# Altium schematic sheet Y_Stepper Motor Driver.SchDoc
size 300 x 299 mm; SheetNumber: 2; SheetTotal: 5
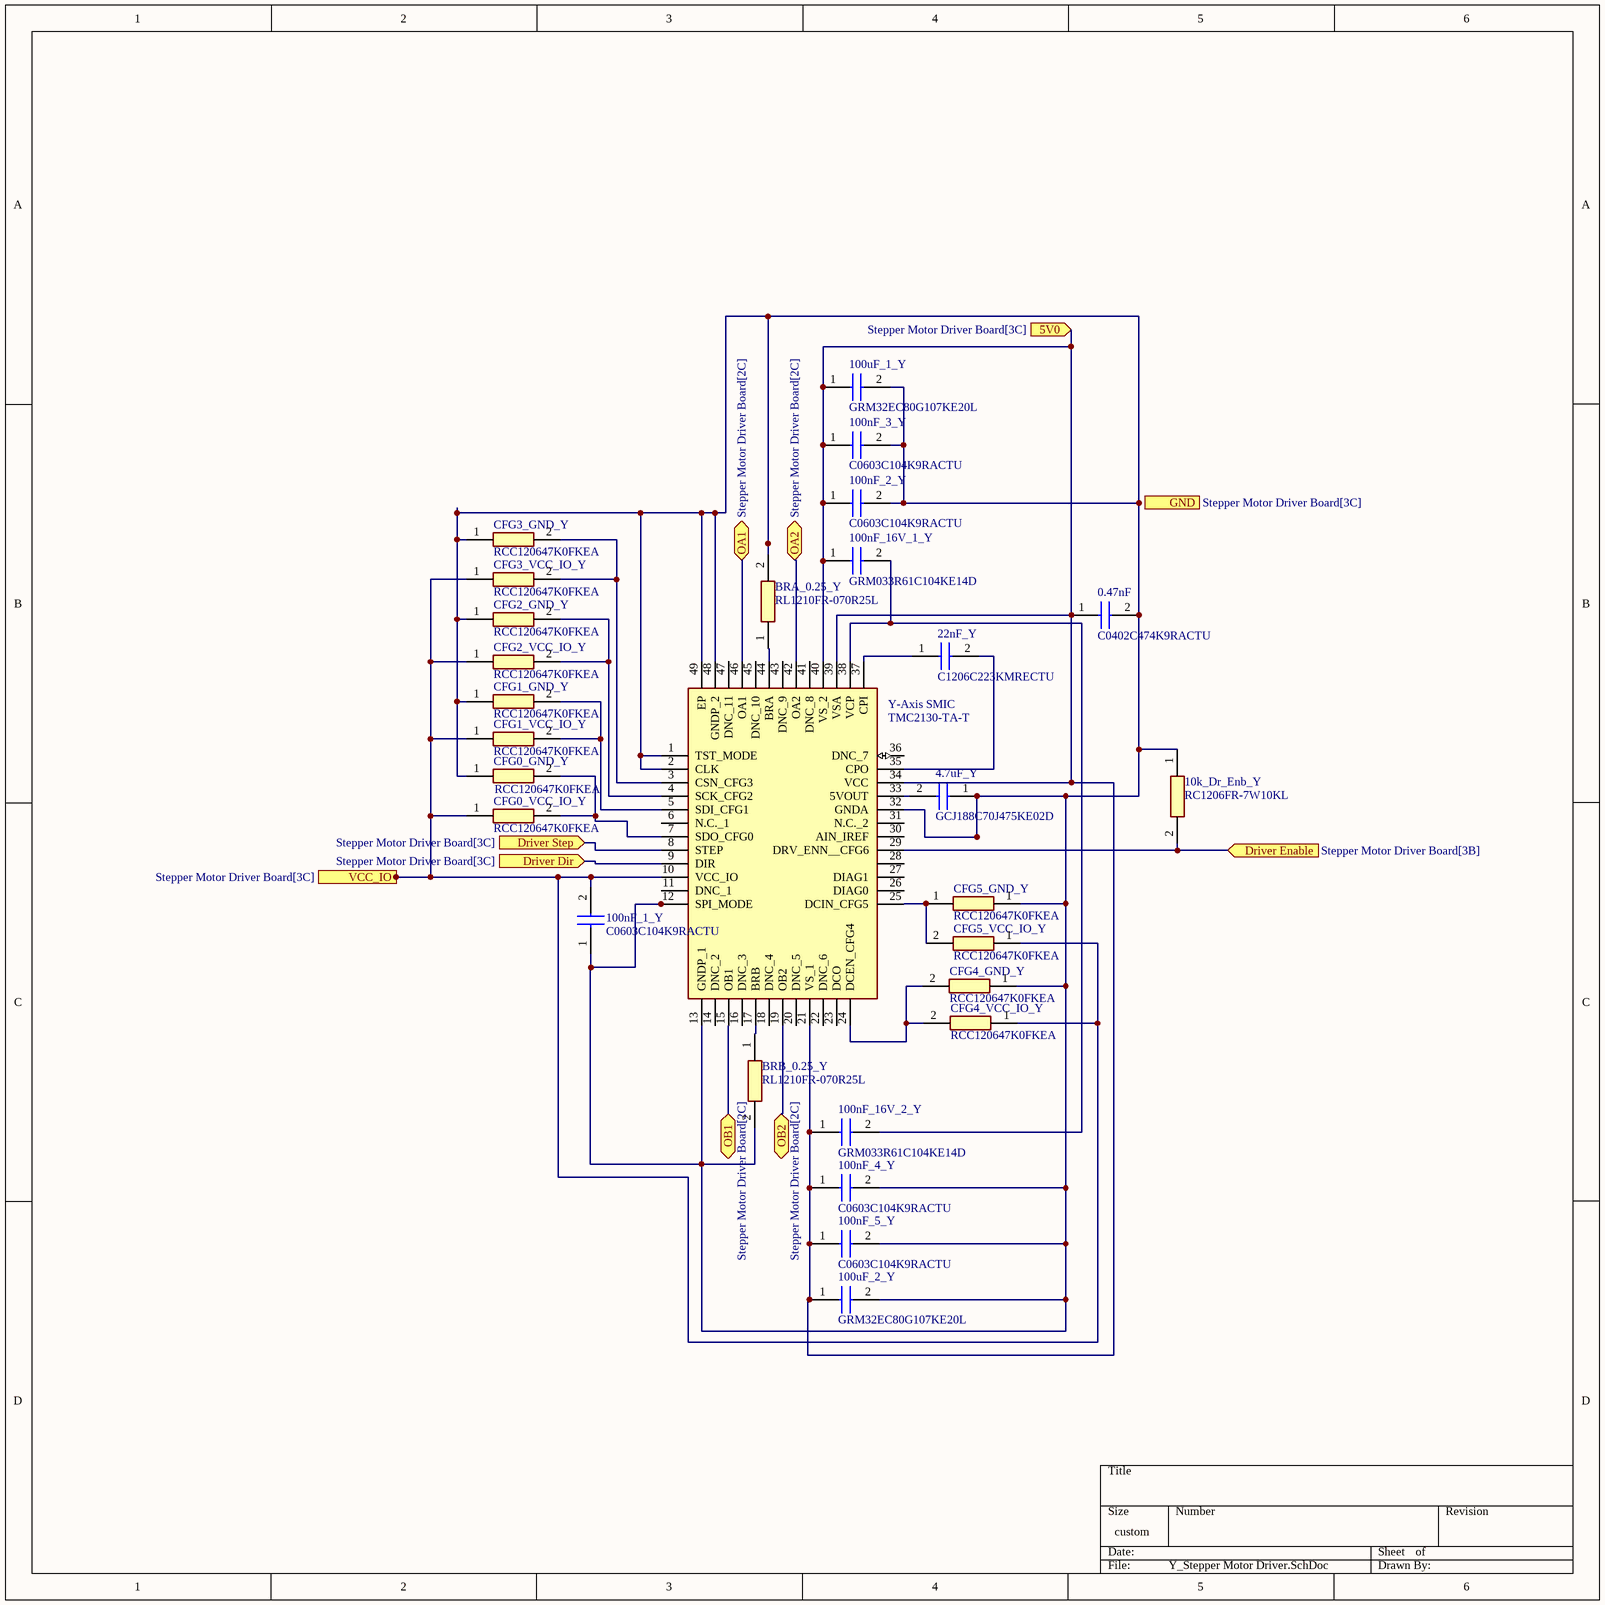
[diagram p0: Y_Stepper Motor Driver.SchDoc]

## Parts
0.47nF  C0402C474K9RACTU  [CAPC1005X55N]
4.7uF_Y  GCJ188C70J475KE02D  [CAPC1608X100N]
10k_Dr_Enb_Y  RC1206FR-7W10KL  [RESC3116X65N]
22nF_Y  C1206C223KMRECTU  [C1206]
100nF_1_Y  C0603C104K9RACTU  [C0603]
100nF_2_Y  C0603C104K9RACTU  [C0603]
100nF_3_Y  C0603C104K9RACTU  [C0603]
100nF_4_Y  C0603C104K9RACTU  [C0603]
100nF_5_Y  C0603C104K9RACTU  [C0603]
100nF_16V_1_Y  GRM033R61C104KE14D  [CAPC0603X33N]
100nF_16V_2_Y  GRM033R61C104KE14D  [CAPC0603X33N]
100uF_1_Y  GRM32EC80G107KE20L  [CAPC3225X270N]
100uF_2_Y  GRM32EC80G107KE20L  [CAPC3225X270N]
BRA_0.25_Y  RL1210FR-070R25L  [RESC3126X65N]
BRB_0.25_Y  RL1210FR-070R25L  [RESC3126X65N]
CFG0_GND_Y  RCC120647K0FKEA  [RCC1206_e3]
CFG0_VCC_IO_Y  RCC120647K0FKEA  [RCC1206_e3]
CFG1_GND_Y  RCC120647K0FKEA  [RCC1206_e3]
CFG1_VCC_IO_Y  RCC120647K0FKEA  [RCC1206_e3]
CFG2_GND_Y  RCC120647K0FKEA  [RCC1206_e3]
CFG2_VCC_IO_Y  RCC120647K0FKEA  [RCC1206_e3]
CFG3_GND_Y  RCC120647K0FKEA  [RCC1206_e3]
CFG3_VCC_IO_Y  RCC120647K0FKEA  [RCC1206_e3]
CFG4_GND_Y  RCC120647K0FKEA  [RCC1206_e3]
CFG4_VCC_IO_Y  RCC120647K0FKEA  [RCC1206_e3]
CFG5_GND_Y  RCC120647K0FKEA  [RCC1206_e3]
CFG5_VCC_IO_Y  RCC120647K0FKEA  [RCC1206_e3]
Y-Axis_SMIC  TMC2130-TA-T  [QFP50P900X900X120-49N]

## Ports
5V0 (in, see Stepper Motor Driver Board[3C]), Driver Dir (in, see Stepper Motor Driver Board[3C]), Driver Enable (in, see Stepper Motor Driver Board[3B]), Driver Step (in, see Stepper Motor Driver Board[3C]), GND (see Stepper Motor Driver Board[3C]), OA1 (bidir, see Stepper Motor Driver Board[2C]), OA2 (bidir, see Stepper Motor Driver Board[2C]), OB1 (bidir, see Stepper Motor Driver Board[2C]), OB2 (bidir, see Stepper Motor Driver Board[2C]), VCC_IO (in, see Stepper Motor Driver Board[3C])

## Nets
5V0: 0.47nF.1 100nF_2_Y.1 100nF_3_Y.1 100nF_4_Y.1 100nF_5_Y.1 100nF_16V_1_Y.1 100nF_16V_2_Y.1 100uF_1_Y.1 100uF_2_Y.1 Y-Axis_SMIC.21(VS_1) Y-Axis_SMIC.34(VCC) Y-Axis_SMIC.39(VSA) Y-Axis_SMIC.40(VS_2) ; port 5V0
Driver Dir: Y-Axis_SMIC.9(DIR) ; port Driver Dir
Driver Enable: 10k_Dr_Enb_Y.2 Y-Axis_SMIC.29(DRV_ENN__CFG6) ; port Driver Enable
Driver Step: Y-Axis_SMIC.8(STEP) ; port Driver Step
OA1: Y-Axis_SMIC.46(OA1) ; port OA1
OA2: Y-Axis_SMIC.42(OA2) ; port OA2
OB1: Y-Axis_SMIC.15(OB1) ; port OB1
OB2: Y-Axis_SMIC.19(OB2) ; port OB2
VCC_IO: 100nF_1_Y.2 CFG0_VCC_IO_Y.1 CFG1_VCC_IO_Y.1 CFG2_VCC_IO_Y.1 CFG3_VCC_IO_Y.1 CFG4_VCC_IO_Y.1 CFG5_VCC_IO_Y.1 Y-Axis_SMIC.10(VCC_IO) ; port VCC_IO
Net0.47nF_2: 0.47nF.2 4.7uF_Y.1 10k_Dr_Enb_Y.1 100nF_1_Y.1 100nF_2_Y.2 100nF_3_Y.2 100nF_4_Y.2 100nF_5_Y.2 100uF_1_Y.2 100uF_2_Y.2 BRA_0.25_Y.2 BRB_0.25_Y.2 CFG0_GND_Y.1 CFG1_GND_Y.1 CFG2_GND_Y.1 CFG3_GND_Y.1 CFG4_GND_Y.1 CFG5_GND_Y.1 Y-Axis_SMIC.1(TST_MODE) Y-Axis_SMIC.2(CLK) Y-Axis_SMIC.12(SPI_MODE) Y-Axis_SMIC.13(GNDP_1) Y-Axis_SMIC.32(GNDA) Y-Axis_SMIC.48(GNDP_2) Y-Axis_SMIC.49(EP)
Net4.7uF_Y_2: 4.7uF_Y.2 Y-Axis_SMIC.33(5VOUT)
Net22nF_Y_1: 22nF_Y.1 Y-Axis_SMIC.37(CPI)
Net22nF_Y_2: 22nF_Y.2 Y-Axis_SMIC.35(CPO)
Net100nF_16V_1_Y_2: 100nF_16V_1_Y.2 100nF_16V_2_Y.2 Y-Axis_SMIC.38(VCP)
NetBRA_0.25_Y_1: BRA_0.25_Y.1 Y-Axis_SMIC.44(BRA)
NetBRB_0.25_Y_1: BRB_0.25_Y.1 Y-Axis_SMIC.17(BRB)
NetCFG0_GND_Y_2: CFG0_GND_Y.2 CFG0_VCC_IO_Y.2 Y-Axis_SMIC.7(SDO_CFG0)
NetCFG1_GND_Y_2: CFG1_GND_Y.2 CFG1_VCC_IO_Y.2 Y-Axis_SMIC.5(SDI_CFG1)
NetCFG2_GND_Y_2: CFG2_GND_Y.2 CFG2_VCC_IO_Y.2 Y-Axis_SMIC.4(SCK_CFG2)
NetCFG3_GND_Y_2: CFG3_GND_Y.2 CFG3_VCC_IO_Y.2 Y-Axis_SMIC.3(CSN_CFG3)
NetCFG4_GND_Y_2: CFG4_GND_Y.2 CFG4_VCC_IO_Y.2 Y-Axis_SMIC.24(DCEN_CFG4)
NetCFG5_GND_Y_1: CFG5_GND_Y.1 CFG5_VCC_IO_Y.2 Y-Axis_SMIC.25(DCIN_CFG5)

Not connected (* = marked no-connect by the designer): Y-Axis_SMIC 6(N.C._1) 11(DNC_1) 14(DNC_2) 16(DNC_3) 18(DNC_4) 20(DNC_5) 22(DNC_6) 23(DCO) 26(DIAG0) 27(DIAG1) 28(DNC_7) 30(AIN_IREF) 31(N.C._2) 36(DNC_7) 41(DNC_8) 43(DNC_9) 45(DNC_10) 47(DNC_11)

## Library data of the parts
0.47nF = C0402C474K9RACTU: Capacitor; Manufacturer_Name: KEMET; Datasheet Link: https://content.kemet.com/datasheets/KEM_C1002_X7R_SMD.pdf; Height: 0.55mm; Manufacturer_Part_Number: C0402C474K9RACTU; Mouser Part Number: 80-C0402C474K9RACTU; Mouser Price/Stock: https://www.mouser.co.uk/ProductDetail/KEMET/C0402C474K9RACTU?qs=iLbezkQI%252BshEQvJDr%2FWmpQ%3D%3D
4.7uF_Y = GCJ188C70J475KE02D: Capacitor; Manufacturer_Name: Murata Electronics; Datasheet Link: https://psearch.en.murata.com/capacitor/product/GCJ188C70J475KE02%23.html; Height: 1mm; Manufacturer_Part_Number: GCJ188C70J475KE02D; Mouser Part Number: 81-GCJ188C70J475KE2D; Mouser Price/Stock: https://www.mouser.co.uk/ProductDetail/Murata-Electronics/GCJ188C70J475KE02D?qs=QzBtWTOodeVfJR8CElrI4A%3D%3D; Arrow Part Number: GCJ188C70J475KE02D; Arrow Price/Stock: https://www.arrow.com/en/products/gcj188c70j475ke02d/murata-manufacturing?region=nac
10k_Dr_Enb_Y = RC1206FR-7W10KL: Resistor; Manufacturer_Name: KEMET; Datasheet Link: https://datasheet.datasheetarchive.com/originals/distributors/Datasheets_SAMA/902f9e387b938f871d31120f5fc1d65e.pdf; Height: 0.65mm; Manufacturer_Part_Number: RC1206FR-7W10KL; Arrow Part Number: RC1206FR-7W10KL; Arrow Price/Stock: https://www.arrow.com/en/products/rc1206fr-7w10kl/yageo
22nF_Y = C1206C223KMRECTU: Capacitor; Manufacturer_Name: KEMET; Datasheet Link: https://content.kemet.com/datasheets/KEM_C1090_X7R_ESD.pdf; Manufacturer_Part_Number: C1206C223KMRECTU; Mouser Part Number: 80-C1206C223KMRECTU; Mouser Price/Stock: https://www.mouser.co.uk/ProductDetail/KEMET/C1206C223KMRECTU?qs=55YtniHzbhA1XbH3T1d9uw%3D%3D
100nF_1_Y 100nF_2_Y 100nF_3_Y 100nF_4_Y 100nF_5_Y = C0603C104K9RACTU: Capacitor; Manufacturer_Name: KEMET; Datasheet Link: https://content.kemet.com/datasheets/KEM_C1002_X7R_SMD.pdf; Height: 0.87mm; Manufacturer_Part_Number: C0603C104K9RACTU; Mouser Part Number: 80-C0603C104K9R; Mouser Price/Stock: https://www.mouser.co.uk/ProductDetail/KEMET/C0603C104K9RACTU?qs=7q2aiX3GdliuPZzPpldOsA%3D%3D; Arrow Part Number: C0603C104K9RACTU; Arrow Price/Stock: https://www.arrow.com/en/products/c0603c104k9ractu/kemet-corporation?region=nac
100nF_16V_1_Y 100nF_16V_2_Y = GRM033R61C104KE14D: Capacitor; Manufacturer_Name: Murata Electronics; Datasheet Link: https://psearch.en.murata.com/capacitor/product/GRM033R61C104KE14%23.html; Height: 0.33mm; Manufacturer_Part_Number: GRM033R61C104KE14D; Mouser Part Number: 81-GRM033R61C104KE4D; Mouser Price/Stock: https://www.mouser.co.uk/ProductDetail/Murata-Electronics/GRM033R61C104KE14D?qs=jHkklCh7amhDvY8zUHp0eA%3D%3D; Arrow Part Number: GRM033R61C104KE14D; Arrow Price/Stock: https://www.arrow.com/en/products/grm033r61c104ke14d/murata-manufacturing?region=nac
100uF_1_Y 100uF_2_Y = GRM32EC80G107KE20L: Capacitor; Manufacturer_Name: Murata Electronics; Datasheet Link: https://datasheet.datasheetarchive.com/originals/distributors/DKDS-10/192475.pdf; Height: 2.7mm; Manufacturer_Part_Number: GRM32EC80G107KE20L; Mouser Part Number: 81-GRM32EC80G107KE0L; Mouser Price/Stock: https://www.mouser.co.uk/ProductDetail/Murata-Electronics/GRM32EC80G107KE20L?qs=eeBpzGFlv%252B8VEtl0LRYzNQ%3D%3D; Arrow Part Number: GRM32EC80G107KE20L; Arrow Price/Stock: https://www.arrow.com/en/products/grm32ec80g107ke20l/murata-manufacturing
BRA_0.25_Y BRB_0.25_Y = RL1210FR-070R25L: Resistor; Manufacturer_Name: KEMET; Datasheet Link: https://www.mouser.de/datasheet/2/447/PYu-RL_Group_521_RoHS_L_2-1131815.pdf; Height: 0.65mm; Manufacturer_Part_Number: RL1210FR-070R25L; Mouser Part Number: 603-RL1210FR-070R25L; Mouser Price/Stock: https://www.mouser.co.uk/ProductDetail/Yageo/RL1210FR-070R25L?qs=k2KEx2DUIRR2Lho3B1zagg%3D%3D
CFG0_GND_Y CFG0_VCC_IO_Y CFG1_GND_Y CFG1_VCC_IO_Y CFG2_GND_Y CFG2_VCC_IO_Y CFG3_GND_Y CFG3_VCC_IO_Y CFG4_GND_Y CFG4_VCC_IO_Y CFG5_GND_Y CFG5_VCC_IO_Y = RCC120647K0FKEA: Resistor; Manufacturer_Name: Vishay; Datasheet Link: https://www.vishay.com/docs/20066/rcce3.pdf; Height: 0.6mm; Manufacturer_Part_Number: RCC120647K0FKEA; Mouser Part Number: 71-RCC120647K0FKEA; Mouser Price/Stock: https://www.mouser.co.uk/ProductDetail/Vishay-Dale/RCC120647K0FKEA?qs=IS%252B4QmGtzzrgga70d3fY5w%3D%3D
Y-Axis_SMIC = TMC2130-TA-T: Integrated Circuit; Manufacturer_Name: TRINAMIC; Datasheet Link: https://www.trinamic.com/fileadmin/assets/Products/ICs_Documents/TMC2130_datasheet.pdf; Height: 1.2mm; Manufacturer_Part_Number: TMC2130-TA-T; Mouser Part Number: 700-TMC2130-TA-T; Mouser Price/Stock: https://www.mouser.co.uk/ProductDetail/Trinamic/TMC2130-TA-T?qs=TiOZkKH1s2SorQX5NhxZsQ%3D%3D